# Altium schematic sheet SW_DIP8.SchDoc: 8-Way DIP Switch
size A4; Organization: Altium Limited.; Address1: Level 3, 12a Rodborough Rd; Address2: Frenchs Forest 2086; Address3: NSW; Address4: AUSTRALIA; Revision: 6; SheetNumber: 63; SheetTotal: 64; PageSetup: Record=PageOptions|CenterHorizontal=True|CenterVertical=True|PrintScale=0.97|XCorrection=1.00|YCorrection=1.00|PrintKind=0|BorderSize=5000000|LeftOffset=0|BottomOffset=0|Orientation=2|PaperLength=1000|PaperWidth=1000|Scale=100|PaperSource=7|PrintQuality=-4|MediaType=1|DitherType=10|PaperKind=A4|PrintScaleMode=1
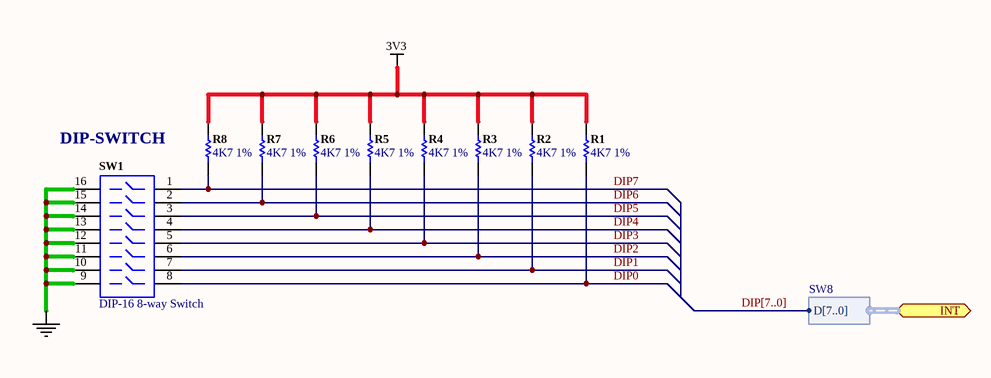
[diagram p0: SW_DIP8.SchDoc]

## Parts
R1  4K7 1%  [RESC1005-STAR]
R2  4K7 1%  [RESC1005-STAR]
R3  4K7 1%  [RESC1005-STAR]
R4  4K7 1%  [RESC1005-STAR]
R5  4K7 1%  [RESC1005-STAR]
R6  4K7 1%  [RESC1005-STAR]
R7  4K7 1%  [RESC1005-STAR]
R8  4K7 1%  [RESC1005-STAR]
SW1  DIP-16 8-way Switch  [DIP-16-KEY]

## Ports
INT (harness SW8)

## Harnesses
SW8: D[7..0]

## Nets
3V3: R1.2 R2.2 R3.2 R4.2 R5.2 R6.2 R7.2 R8.2
GND: SW1.9 SW1.10 SW1.11 SW1.12 SW1.13 SW1.14 SW1.15 SW1.16
DIP0: R1.1 SW1.8
DIP1: R2.1 SW1.7
DIP2: R3.1 SW1.6
DIP3: R4.1 SW1.5
DIP4: R5.1 SW1.4
DIP5: R6.1 SW1.3
DIP6: R7.1 SW1.2
DIP7: R8.1 SW1.1

## Buses and harness runs
bus DIP[7..0]

## Notes on the sheet
- DIP-SWITCH
- Sheet Title
- Project Title
- Size:
- Date:
- A4
- Assy:
- Time:
- Sheet
- Revision:
- of
- File:

## Library data of the parts
R1-R8 = D-100-0088: Resistor, 4K7 1% 0402 (1005); Power Rating: 63 mW; Resistance: 4.7 K; Category: Resistor; Mounting Technology: Surface Mount; Status: Production; Tolerance: 1 %
SW1 = D-301-0003: Switch, DIP Black 8-Way 300mil x 100mil; Rated Voltage: mV; Switch Type: SPDT; Category: Switch; Mounting Technology: Surface Mount; Status: Production